# EasyEDA Pro project scd41.eprj

# Schematic Schematic1
Board Name: Board1; Create Date: 2025-09-26; Page Name: P1; Project Name: scd41; Schematic Name: Schematic1; Update Date: 2025-09-26; Company: 嘉立创EDA; Page Size: A4; Version: V1.0
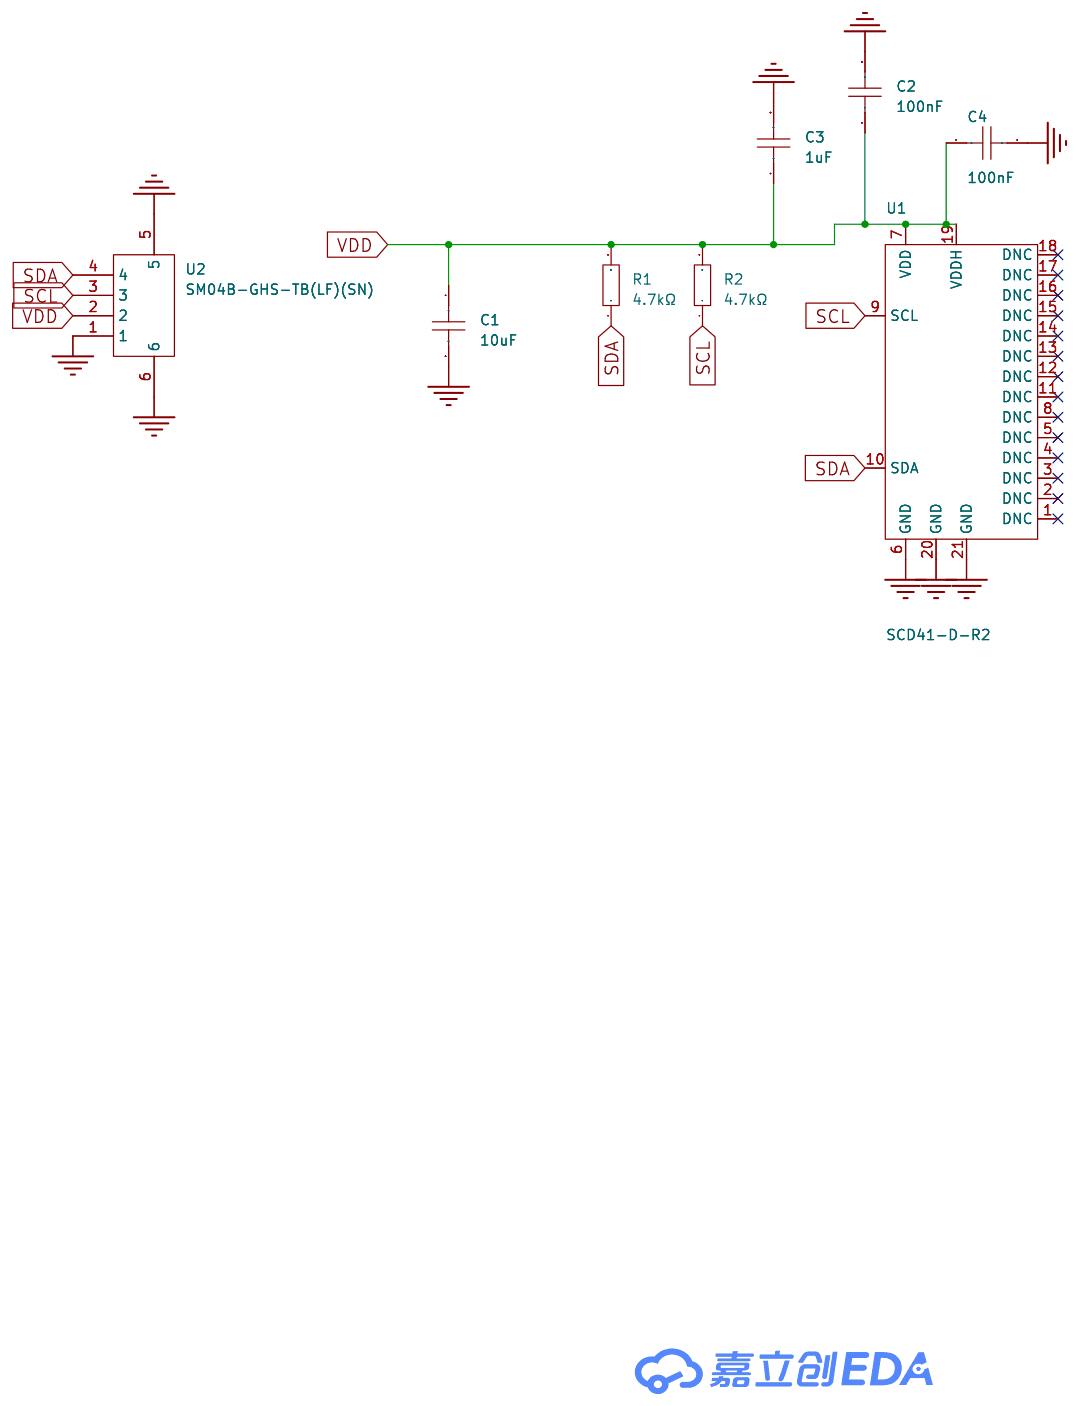
[diagram p0: schematic sheet]

## Parts
C1  10uF  [C0603]
C2  100nF  [C0603]
C3  1uF  [C0603]
C4  100nF  [C0603]
R1  4.7kΩ  [R0603]
R2  4.7kΩ  [R0603]
U1  SCD41-D-R2  [LGA-20_L10.1-W10.1-P1.25-TL]
U2  SM04B-GHS-TB(LF)(SN)  [CONN-SMD_4P-P1.25_SM04B-GHS-TB-LF-SN]

## Library data of the parts
C1 = CL10A106MA8NRNC: LCSC Part Name: 10uF ±20% 25V; Supplier Part: C96446; Manufacturer: SAMSUNG(三星); Supplier Footprint: 0603; JLCPCB Part Class: 基础库; Datasheet: https://item.szlcsc.com/datasheet/CL10A106MA8NRNC/97651.html; Supplier: LCSC; Tolerance: ±20%; Voltage Rating: 25V; Temperature Coefficient: X5R
C2 C4 = CL10B104KB8NNNC: LCSC Part Name: 100nF ±10% 50V; Supplier Part: C1591; Manufacturer: SAMSUNG(三星); Supplier Footprint: 0603; JLCPCB Part Class: 扩展库; Datasheet: https://item.szlcsc.com/datasheet/CL10B104KB8NNNC/1943.html; Supplier: LCSC; Tolerance: ±10%; Voltage Rating: 50V; Temperature Coefficient: X7R
C3 = CL10A105KB8NNNC: LCSC Part Name: 1uF ±10% 50V; Supplier Part: C15849; Manufacturer: SAMSUNG(三星); Supplier Footprint: 0603; JLCPCB Part Class: 基础库; Datasheet: https://item.szlcsc.com/datasheet/CL10A105KB8NNNC/16531.html; Supplier: LCSC; Tolerance: ±10%; Voltage Rating: 50V; Temperature Coefficient: X5R
R1 R2 = 0603WAF4701T5E: LCSC Part Name: 4.7kΩ ±1% 100mW 厚膜电阻; Supplier Part: C23162; Manufacturer: UNI-ROYAL(厚声); Supplier Footprint: 0603; JLCPCB Part Class: 基础库; Datasheet: https://item.szlcsc.com/datasheet/0603WAF4701T5E/23889.html; Supplier: LCSC; Type: 厚膜电阻; Tolerance: ±1%; Power(Watts): 100mW; Voltage-Supply(Max): 75V; Temperature Coefficient: ±100ppm/℃; Operating Temperature: -55℃~+155℃
U1 = SCD41-D-R2: Supplier Part: C9900006734; Supplier Footprint: SMD-20_L10.1-W10.1-P1.25; JLCPCB Part Class: 扩展库; Supplier: LCSC
U2 = SM04B-GHS-TB(LF)(SN): LCSC Part Name: 1x4P 间距:1.25mm 卧贴 系列:GH; Supplier Part: C189895; Manufacturer: JST; Supplier Footprint: SMD,P=1.25mm,卧贴; JLCPCB Part Class: 扩展库; Datasheet: https://atta.szlcsc.com/upload/public/pdf/source/20180323/112205B2CF875947C9562BFC7B01FA26.pdf; Supplier: LCSC; Pins Structure: 1x4P; Pitch: 1.25mm; Mounting Style: 卧贴; Reference Series: GH; Number of Pins: 4P; Number of Rows: 1; Number of PINs Per Row: 4; Current Rating (Max): 1A; Contact Material: 磷青铜; Contact Plating: 锡; Operating Temperature Range: -25℃~+85℃; Rated Voltage (Max): 50V; Plastic Material: PA9T; Flame Retardant Rating: UL94V-0; Supplementary Features: 辅助焊脚; Colour: 白色; Z-Height of the Board: 4.25mm; X-Length of Bottom Edge on Board (Spacing Line): 8.25mm; Y-Width of Bottom Edge on Board: 4.13mm

## Nets
GND: C1.2 C2.2 C3.2 C4.1 U1.6(GND) U1.20(GND) U1.21(GND) U2.1 U2.5 U2.6
VDD: C1.1 C2.1 C3.1 C4.2 R1.2 R2.2 U1.7(VDD) U1.19(VDDH) U2.2
SCL: R2.1 U1.9(SCL) U2.3
SDA: R1.1 U1.10(SDA) U2.4

Not connected (* = marked no-connect by the designer): U1 1(DNC)* 2(DNC)* 3(DNC)* 4(DNC)* 5(DNC)* 8(DNC)* 11(DNC)* 12(DNC)* 13(DNC)* 14(DNC)* 15(DNC)* 16(DNC)* 17(DNC)* 18(DNC)*

# Board PCB1
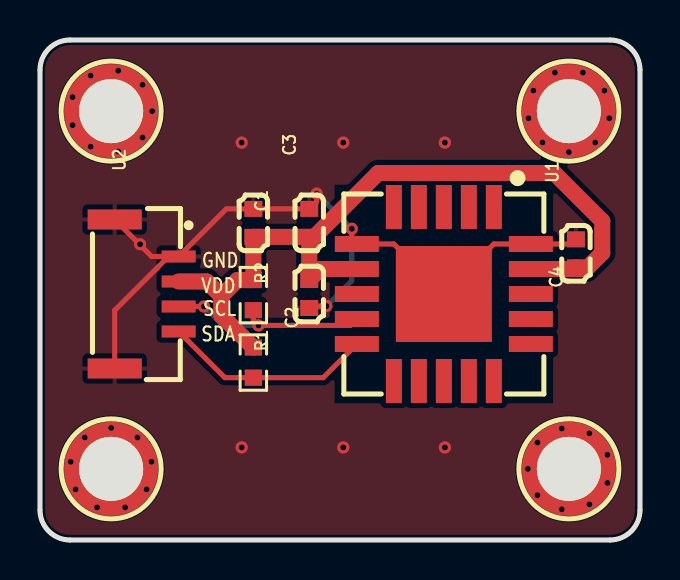
[diagram p1: board, top side]
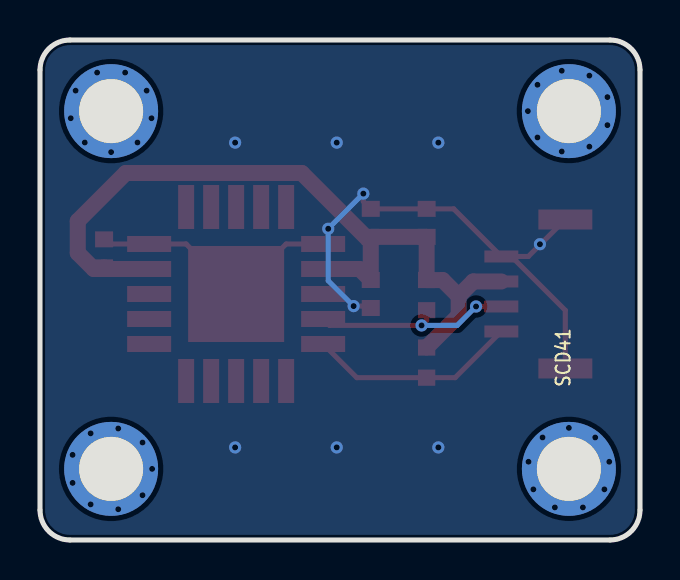
[diagram p2: board, bottom side, seen from below]

Outline 30 x 25 mm; copper layers: Top Layer, Bottom Layer. Coordinates in mm from the lower left corner of the outline.
Outline path: 0,23.5 0,1.5 arc(0.44,0.44) 1.5,0 28.5,0 arc(29.56,0.44) 30,1.5 30,23.5 arc(29.56,24.56) 28.5,25 1.5,25 arc(0.44,24.56) 0,23.5
Stack: Top Layer 0.035mm / Dielectric1 1.51mm FR4 er 4.5 / Bottom Layer 0.035mm

## Design rules (mm)
template: 自定义配置
spacing copperThickness1oz (default): track to track 0.102, other pairs 0.152 to 0.3
spacing copperThickness2oz: track to track 0.203, other pairs 0.152 to 0.3
track width copperThickness1oz (default): min 0.127, default 0.254, max 2.54
track width copperThickness2oz: min 0.203, default 0.254, max 2.54
track width 3v3: min 0.8, default 0.8, max 2.54
differential pair differentialPair (default): width min 0.127, default 0.254, max 2.54; gap min 0.152, default 0.152
via viaSize (default): diameter min 0.5, default 0.61, max 10; hole min 0.3, default 0.305, max 6.3
net VDD uses 3v3

## Placement (name value [footprint] x y rotation side)
C1  10uF  [C0603]  10.67 15.86 90 top
C2  100nF  [C0603]  13.46 12.3 270 top
C3  1uF  [C0603]  13.46 15.86 90 top
C4  100nF  [C0603]  26.8 14.33 270 top
NOREF  -  [Pad_e48]  3.56 21.44 0 top
NOREF#2  -  [Pad_e662]  26.44 3.56 180 top
NOREF#3  -  [Pad_e674]  3.56 3.56 90 top
NOREF#4  -  [Pad_e638]  26.44 21.44 270 top
R1  4.7kΩ  [R0603]  10.67 8.87 90 top
R2  4.7kΩ  [R0603]  10.67 12.24 90 top
U1  SCD41-D-R2  [LGA-20_L10.1-W10.1-P1.25-TL]  20.19 12.3 270 top
U2  SM04B-GHS-TB(LF)(SN)  [CONN-SMD_4P-P1.25_SM04B-GHS-TB-LF-SN]  5.33 12.3 270 top

## Footprints (pads in the part's own frame, mm; a bottom-side part is the same pattern mirrored in y, then rotated)
C0603
  rect 0.8x0.9 smd: 1(-0.7,0) 2(0.7,0)
CONN-SMD_4P-P1.25_SM04B-GHS-TB-LF-SN
  rect 0.6x1.7 smd: 1(-1.875,1.599) 2(-0.625,1.599) 3(0.625,1.599) 4(1.875,1.599)
  rect 1x2.7 smd: 5(3.724,-1.599) 6(-3.724,-1.599)
LGA-20_L10.1-W10.1-P1.25-TL
  rect 2.2x0.8 smd: 1(-4.35,2.5) 2(-4.35,1.25) 3(-4.35,0) 4(-4.35,-1.25) 5(-4.35,-2.5) 11(4.35,-2.5) 12(4.35,-1.25) 13(4.35,0) 14(4.35,1.25) 15(4.35,2.5)
  rect 0.8x2.2 smd: 6(-2.5,-4.35) 7(-1.25,-4.35) 8(0,-4.35) 9(1.25,-4.35) 10(2.5,-4.35) 16(2.5,4.35) 17(1.25,4.35) 18(0,4.35) 19(-1.25,4.35) 20(-2.5,4.35)
  rect 4.8x4.8 smd: 21(0,0)
Pad_e48
  round 4.7 hole 3.2: 1(0,0)
Pad_e638
  round 4.7 hole 3.2: 1(0,0)
Pad_e662
  round 4.7 hole 3.2: 1(0,0)
Pad_e674
  round 4.7 hole 3.2: 1(0,0)
R0603
  rect 0.806x0.864 smd: 1(-0.753,0) 2(0.753,0)

## Nets
As in the schematic.

Pads without a net: NOREF 1; NOREF#2 1; NOREF#3 1; NOREF#4 1; U1 1 2 3 4 5 8 11 12 13 14 15 16 17 18

## Via types
v1: diameter 0.5, hole 0.3, Top Layer to Bottom Layer, 36 vias
v2: diameter 0.61, hole 0.305, Top Layer to Bottom Layer, 12 vias

## Routing (per net, layer and track width the routed paths; a pad name or vN(x,y) marks a point on that pad's centre or on a via; arc(x,y) is an arc through that point)
GND: length 40.9
  Top Layer w0.254: v2(15.59,15.56) 15.59,15.05 U1.6 17.69,14.8 U1.21 22.69,14.8 U1.20 26.56,14.8 C4.1 ; U2.5 3.73,11.48 6.43,14.18 ; v2(14.32,11.7) 13.56,11.7 C2.2 ; 6.43,14.18 5.58,14.18 U2.6 ; 6.43,14.18 U2.1 9.31,16.56 C1.2 C3.2 13.83,16.93 v2(13.83,17.32)
  Bottom Layer w0.254: v2(14.32,11.7) 15.59,12.97 v2(15.59,15.56) v2(13.83,17.32)
  vias: v2(5,14.79) v2(10.08,19.87) v2(10.08,4.63) v2(15.16,19.87) v2(15.16,4.63) v2(20.24,19.87) v2(20.24,4.63)
VDD: length 39.8
  Top Layer w0.8: 26.71,13.55 C4.2 ; 26.71,13.55 27.31,13.55 28.11,14.35 28.11,15.95 25.71,18.35 16.91,18.35 13.46,14.9 C2.1 14.01,13.55 U1.7 ; 26.71,13.55 U1.19 ; R1.2 9.07,11.22 9.07,12.2 ; 9.07,12.2 9.87,13 R2.2 C1.1 C3.1 ; 9.07,12.2 8.34,12.93 U2.2
(no net):
  vias: v1(1.54,3.91) v1(1.63,22.14) v1(1.63,20.74) v1(1.78,2.53) v1(2.24,5.13) v1(2.53,23.22) v1(2.53,19.67) v1(2.85,1.63) v1(3.56,5.61) v1(3.91,23.46) v1(3.91,19.42) v1(4.26,1.63) v1(4.87,5.13) v1(5.13,22.76) v1(5.13,20.13) v1(5.33,2.53) v1(5.57,3.91) v1(5.61,21.44) v1(24.39,3.56) v1(24.42,21.09) v1(24.67,22.47) v1(24.87,4.87) v1(24.87,2.24) v1(25.13,19.87) v1(25.74,23.37) v1(26.09,5.58) v1(26.09,1.54) v1(26.44,19.39) v1(27.14,23.37) v1(27.47,5.33) v1(27.47,1.78) v1(27.76,19.87) v1(28.22,22.47) v1(28.37,4.26) v1(28.37,2.86) v1(28.46,21.09)
SCL: length 10.3
  Top Layer w0.254: v2(8.2,11.68) U2.3 ; R2.1 10.67,10.98 v2(10.92,10.73) 15.52,10.73 U1.9
  Bottom Layer w0.254: v2(10.92,10.73) 9.14,10.73 v2(8.2,11.68)
SDA: length 10.6
  Top Layer w0.254: U1.10 14.16,8.12 R1.1 9.24,8.12 U2.4 6.95,10.43

## Copper pours and planes (outline as drawn; the poured copper is in the pictures)
GND on Top Layer: -0.38,25.38 30.35,25.38 30.35,-0.27 -0.38,-0.27
GND on Bottom Layer: -0.38,25.38 30.35,25.38 30.35,-0.27 -0.38,-0.27

## Text on the board
Bottom Silkscreen Layer: SCD41
Top Silkscreen Layer: SDA | SCL | VDD | GND
